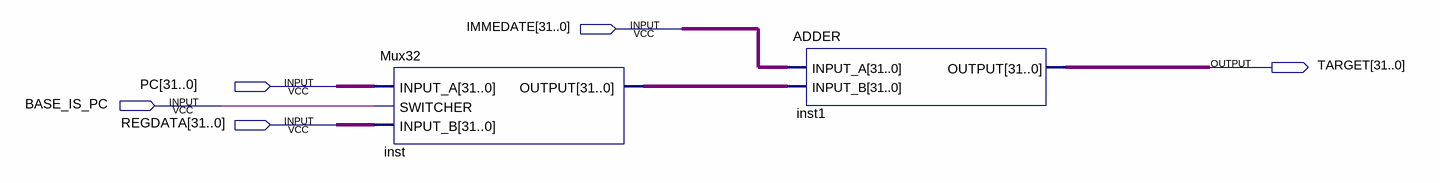
[diagram p0: schematic sheet]
// Quartus schematic JumpUnit.bdf as structural Verilog: 2 symbols, 5 pins
module JumpUnit (
  input  [31:0] IMMEDATE,
  input  [31:0] PC,
  input  BASE_IS_PC,
  input  [31:0] REGDATA,
  output [31:0] TARGET
);

  wire [31:0] inst_output;

  Mux32 inst (.INPUT_A(PC), .SWITCHER(BASE_IS_PC), .INPUT_B(REGDATA), .OUTPUT(inst_output));
  ADDER inst1 (.INPUT_A(IMMEDATE), .INPUT_B(inst_output), .OUTPUT(TARGET));
endmodule
